# EAGLE design pcb-bldc-high-current (EAGLE 9.6.2)
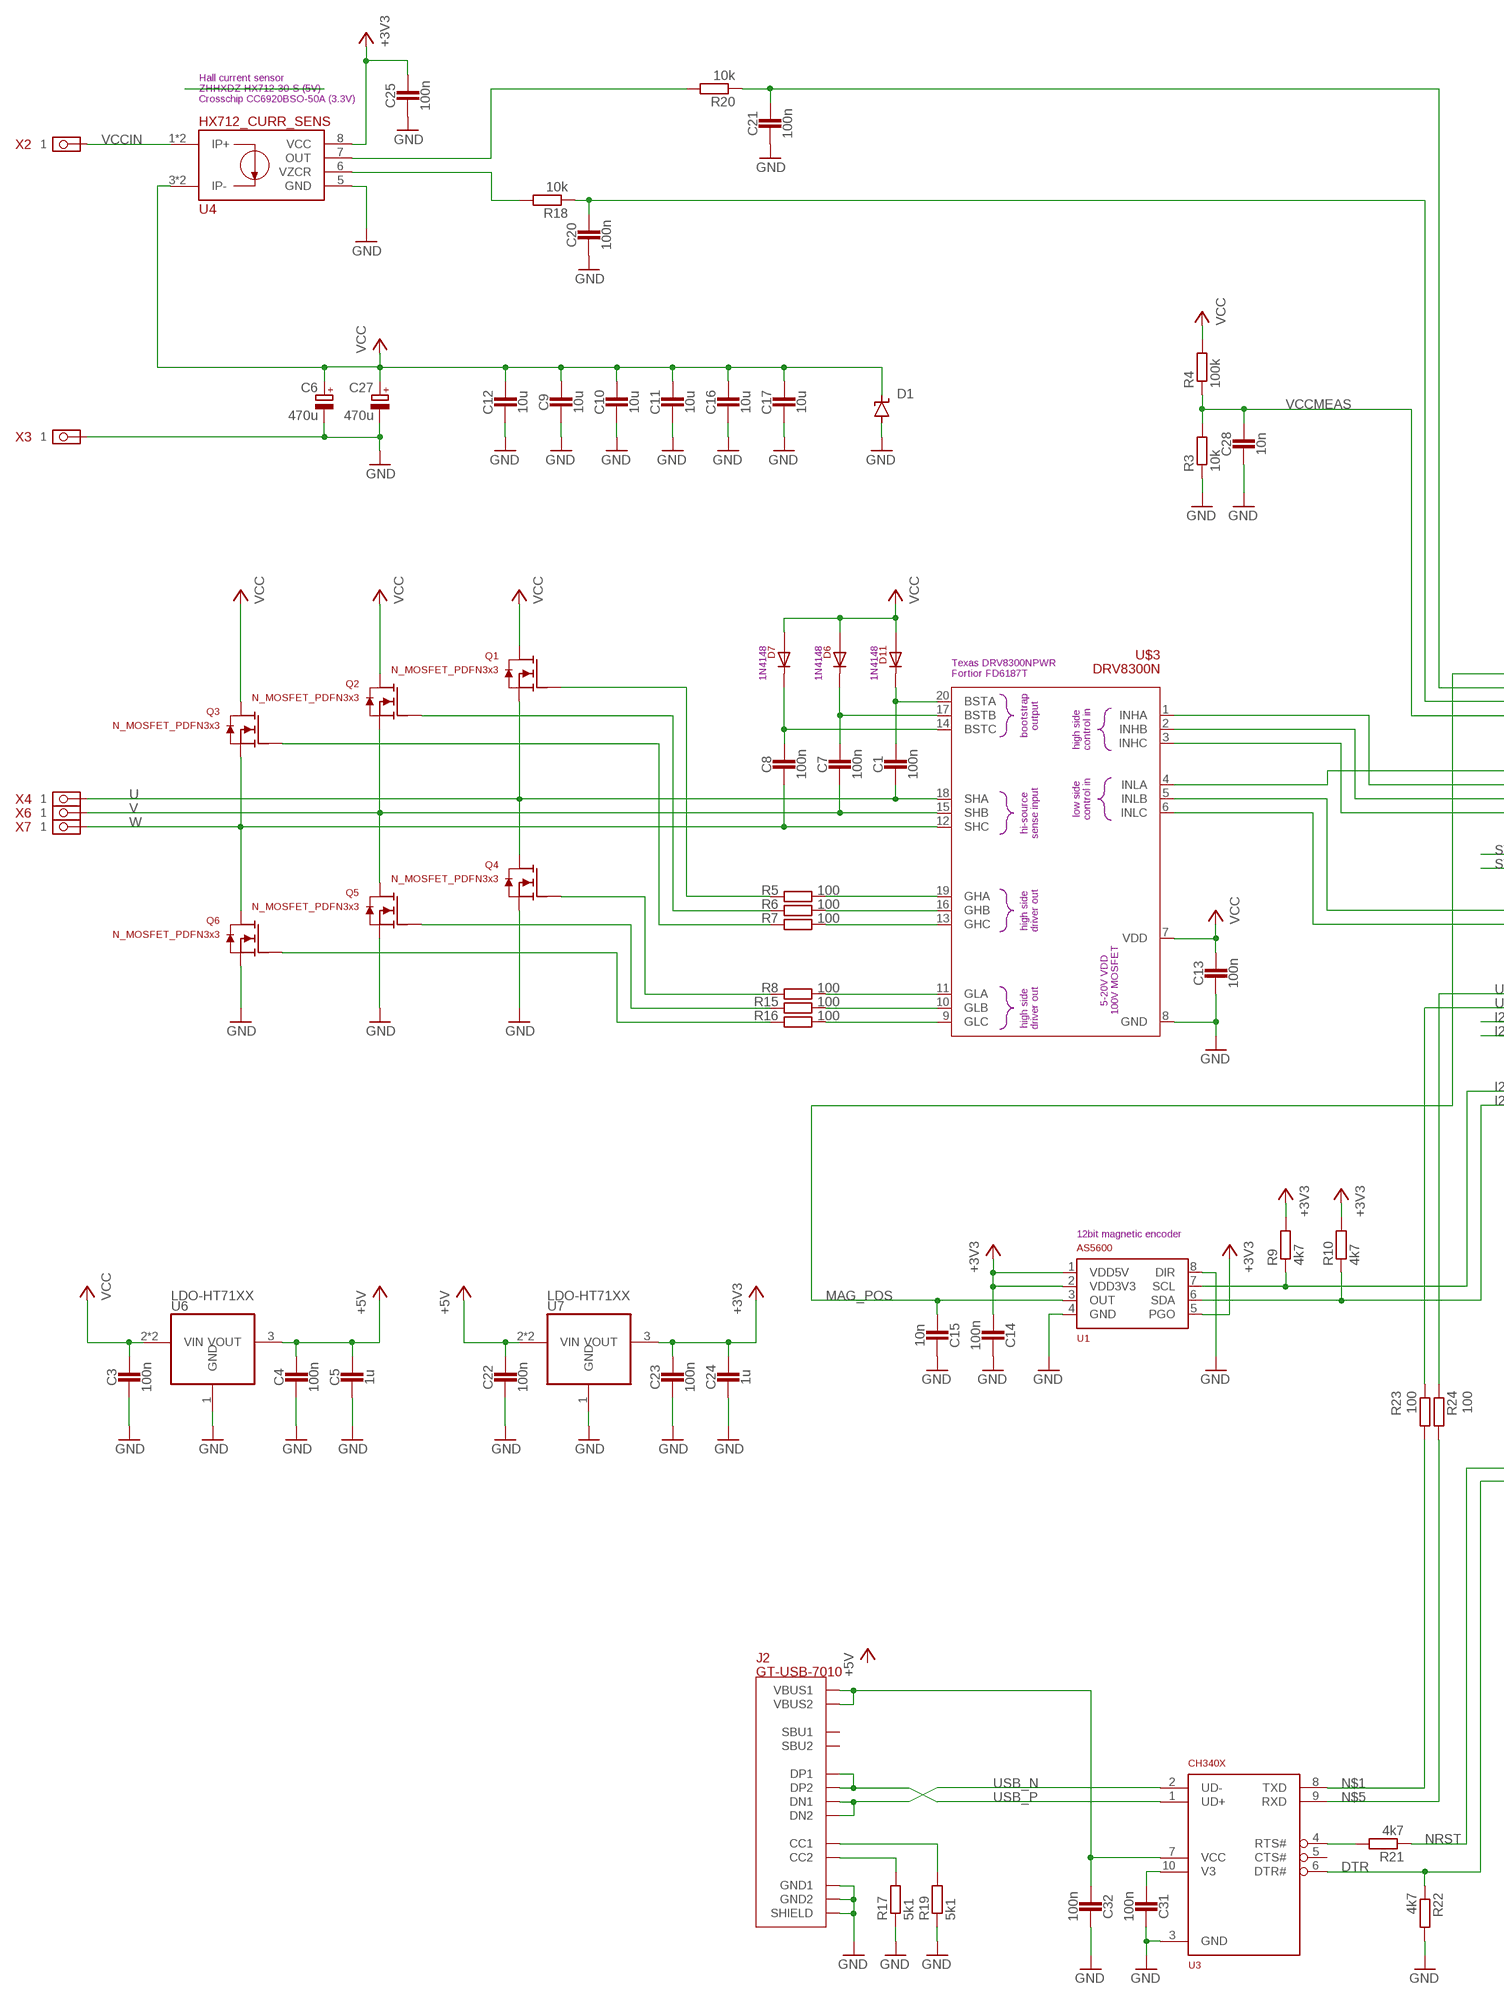
[diagram p0: schematic, sheet 1, part 1 of 2]
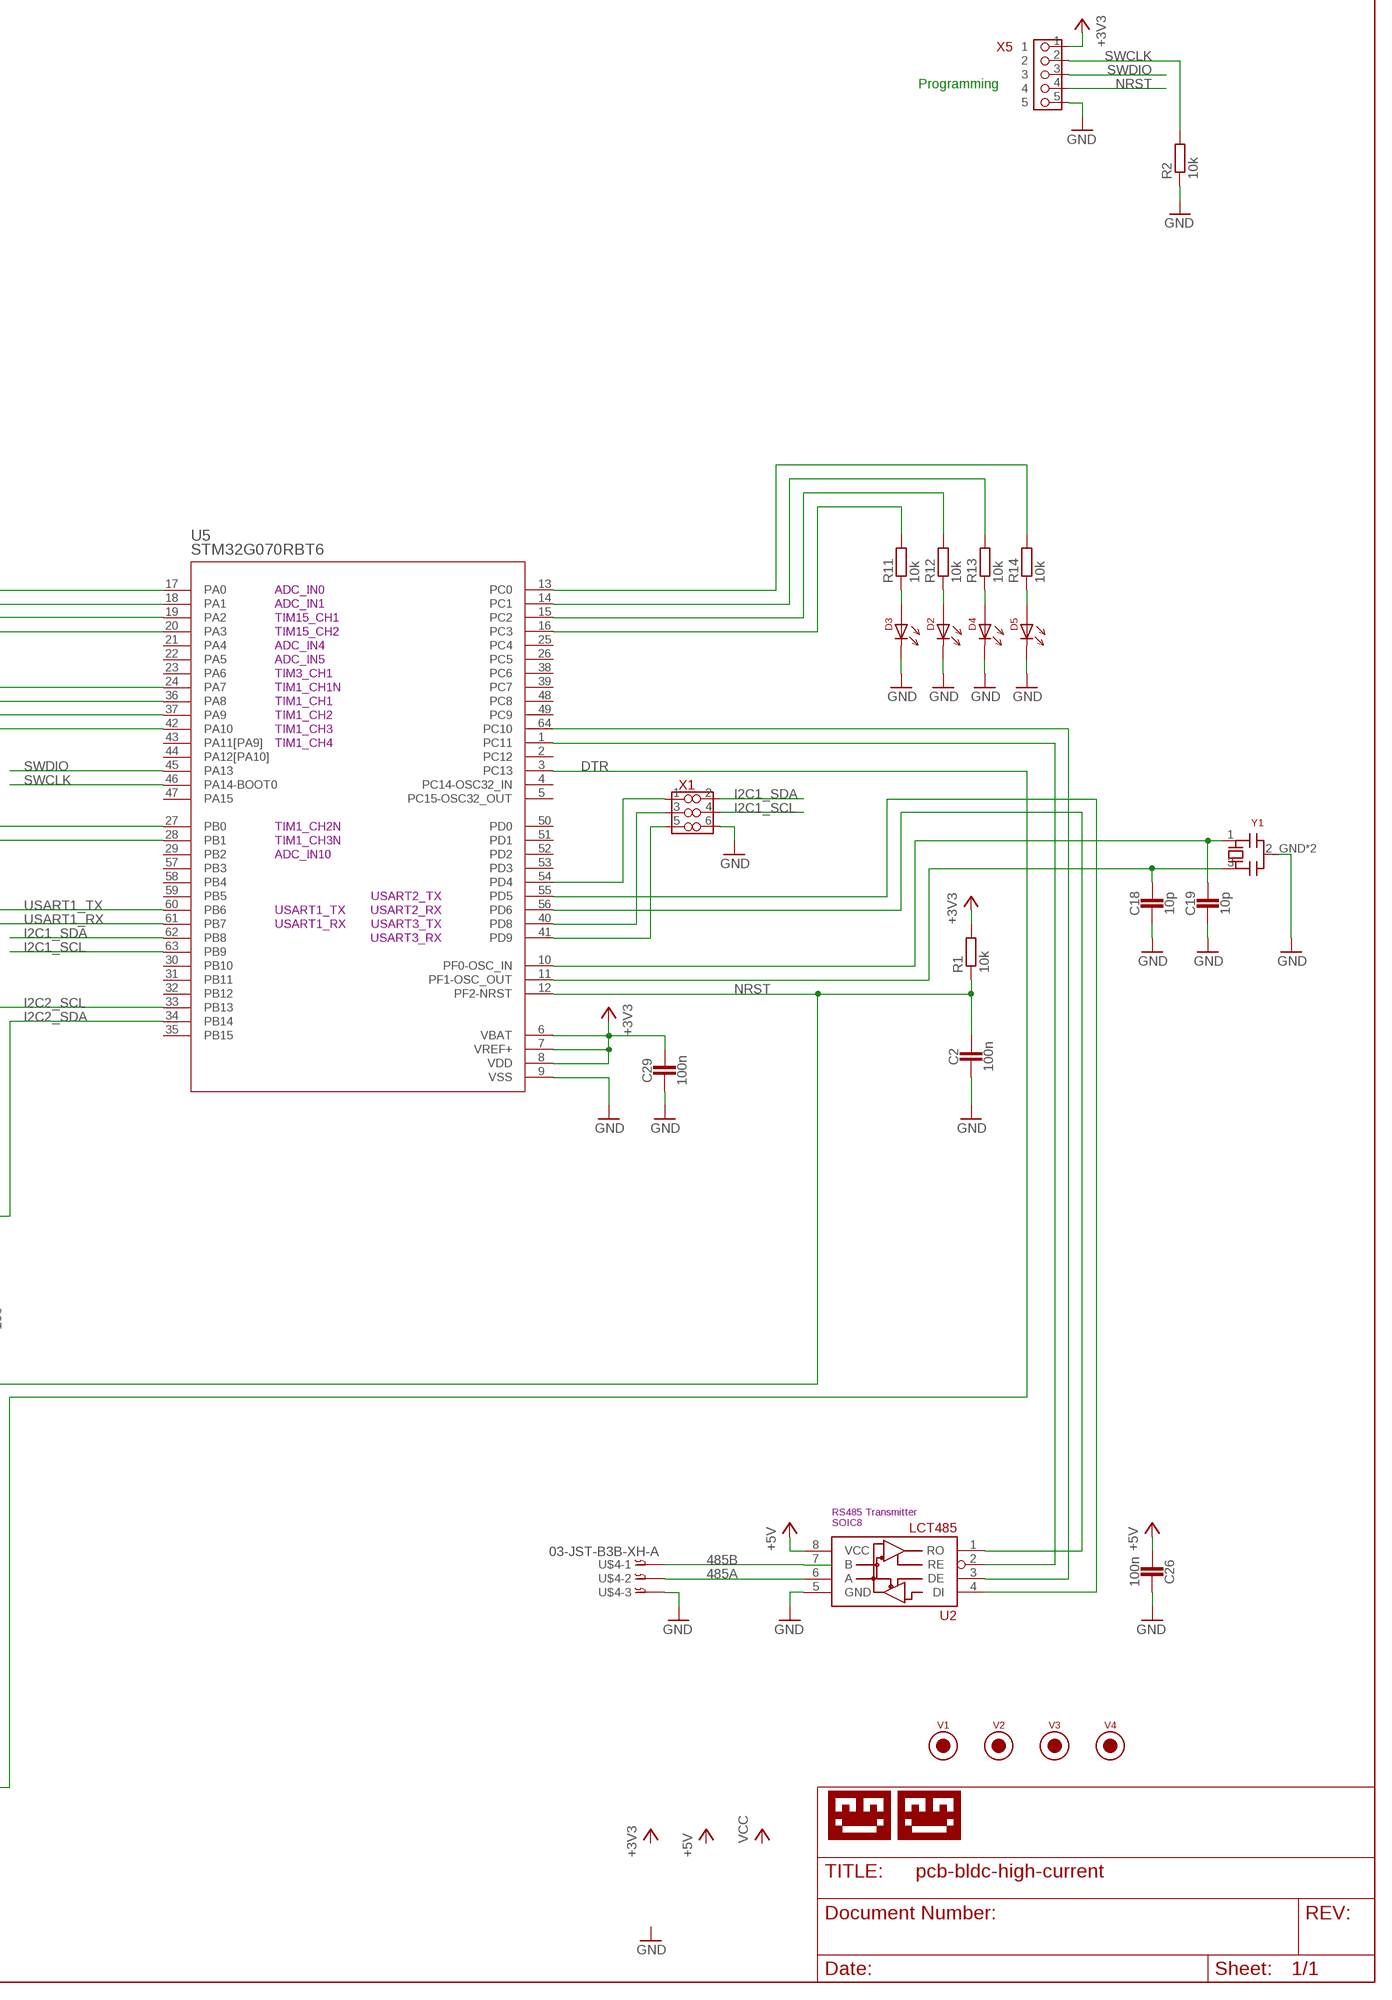
[diagram p1: schematic, sheet 1, part 2 of 2]

## Parts
C1  100n  CAPACITOR0603_CAP  [0603_CAP]
C2  100n  CAPACITOR0603_CAP  [0603_CAP]
C3  100n  CAPACITOR0603_CAP  [0603_CAP]
C4  100n  CAPACITOR0603_CAP  [0603_CAP]
C5  1u  CAPACITOR0603_CAP  [0603_CAP]
C6  470u  CPOL-EU153CLV-1010  [153CLV-1010]
C7  100n  CAPACITOR0603_CAP  [0603_CAP]
C8  100n  CAPACITOR0603_CAP  [0603_CAP]
C9  10u  CAPACITOR1206_CAP  [1206_CAP]
C10  10u  CAPACITOR1206_CAP  [1206_CAP]
C11  10u  CAPACITOR1206_CAP  [1206_CAP]
C12  10u  CAPACITOR1206_CAP  [1206_CAP]
C13  100n  CAPACITOR0603_CAP  [0603_CAP]
C14  100n  CAPACITOR0603_CAP  [0603_CAP]
C15  10n  CAPACITOR0603_CAP  [0603_CAP]
C16  10u  CAPACITOR1206_CAP  [1206_CAP]
C17  10u  CAPACITOR1206_CAP  [1206_CAP]
C18  10p  CAPACITOR0603_CAP  [0603_CAP]
C19  10p  CAPACITOR0603_CAP  [0603_CAP]
C20  100n  CAPACITOR0603_CAP  [0603_CAP]
C21  100n  CAPACITOR0603_CAP  [0603_CAP]
C22  100n  CAPACITOR0603_CAP  [0603_CAP]
C23  100n  CAPACITOR0603_CAP  [0603_CAP]
C24  1u  CAPACITOR0603_CAP  [0603_CAP]
C25  100n  CAPACITOR0603_CAP  [0603_CAP]
C26  100n  CAPACITOR0603_CAP  [0603_CAP]
C27  470u  CPOL-EU153CLV-1010  [153CLV-1010]
C28  10n  CAPACITOR0603_CAP  [0603_CAP]
C29  100n  CAPACITOR0603_CAP  [0603_CAP]
C31  100n  CAPACITOR0603_CAP  [0603_CAP]
C32  100n  CAPACITOR0603_CAP  [0603_CAP]
D1  SUPPRESSOR-SMBJ  [SMBJ]
D2  LED-0805  [0805-DOT]
D3  LED-0805  [0805-DOT]
D4  LED-0805  [0805-DOT]
D5  LED-0805  [0805-DOT]
D6  DIODESOD123  [SOD123]
D7  DIODESOD123  [SOD123]
D11  DIODESOD123  [SOD123]
J2  GT-USB-7010  [GT-USB-7010]
Q1  N_MOSFET_PDFN3x3  MOSFET_NHL60N04D  [DFN3X3-8L]
Q2  N_MOSFET_PDFN3x3  MOSFET_NHL60N04D  [DFN3X3-8L]
Q3  N_MOSFET_PDFN3x3  MOSFET_NHL60N04D  [DFN3X3-8L]
Q4  N_MOSFET_PDFN3x3  MOSFET_NHL60N04D  [DFN3X3-8L]
Q5  N_MOSFET_PDFN3x3  MOSFET_NHL60N04D  [DFN3X3-8L]
Q6  N_MOSFET_PDFN3x3  MOSFET_NHL60N04D  [DFN3X3-8L]
R1  10k  RESISTOR0603_RES  [0603-RES]
R2  10k  RESISTOR0603_RES  [0603-RES]
R3  10k  RESISTOR0603_RES  [0603-RES]
R4  100k  RESISTOR0603_RES  [0603-RES]
R5  100  RESISTOR0603_RES  [0603-RES]
R6  100  RESISTOR0603_RES  [0603-RES]
R7  100  RESISTOR0603_RES  [0603-RES]
R8  100  RESISTOR0603_RES  [0603-RES]
R9  4k7  RESISTOR0603_RES  [0603-RES]
R10  4k7  RESISTOR0603_RES  [0603-RES]
R11  10k  RESISTOR0603_RES  [0603-RES]
R12  10k  RESISTOR0603_RES  [0603-RES]
R13  10k  RESISTOR0603_RES  [0603-RES]
R14  10k  RESISTOR0603_RES  [0603-RES]
R15  100  RESISTOR0603_RES  [0603-RES]
R16  100  RESISTOR0603_RES  [0603-RES]
R17  5k1  RESISTOR0603_RES  [0603-RES]
R18  10k  RESISTOR0603_RES  [0603-RES]
R19  5k1  RESISTOR0603_RES  [0603-RES]
R20  10k  RESISTOR0603_RES  [0603-RES]
R21  4k7  RESISTOR0603_RES  [0603-RES]
R22  4k7  RESISTOR0603_RES  [0603-RES]
R23  100  RESISTOR0603_RES  [0603-RES]
R24  100  RESISTOR0603_RES  [0603-RES]
U1  AS5600  [SOIC-8]
U2  LCT485_BUS_TRANSCEIVER  [SOIC-8]
U3  CH340X  [MSOP-10]
U4  HX712_CURR_SENS  [SOIC-8]
U5  STM32G070RBT6  [LQFP-64]
U6  LDO-HT71XX  [SOT-89]
U7  LDO-HT71XX  [SOT-89]
U$1  LOGO-TOBENG-1MM-FINISH  [TOBENG-1MM-FINISH]
U$2  LOGO-0.25MM  [LOGO-0.25MM]
U$3  DRV8300N  DRV8300  [TSSOP20]
U$4  03-JST-B3B-XH-A  [B3B-XH]
V1  FIDUCIAL2MM  [FIDUCIAL_2MM]
V2  FIDUCIAL2MM  [FIDUCIAL_2MM]
V3  FIDUCIAL2MM  [FIDUCIAL_2MM]
V4  FIDUCIAL2MM  [FIDUCIAL_2MM]
X1  PIN_3X2HD  [PIN_3X2_HD]
X2  PIN_1X1WELDINGTERMINAL  [XFCNTS34031]
X3  PIN_1X1WELDINGTERMINAL  [XFCNTS34031]
X4  PIN_1X1WIRE1  [PIN_1X1_SOLDERWIRE_1]
X5  PIN_5X1HD  [PIN_5X1_HD]
X6  PIN_1X1WIRE1  [PIN_1X1_SOLDERWIRE_1]
X7  PIN_1X1WIRE1  [PIN_1X1_SOLDERWIRE_1]
Y1  3213-QUARZ3225  [3225-QUARZ]

## Nets
485A: U2.6(A) U$4.P$2
485B: U2.7(B) U$4.P$1
+3V3: C14.1 C23.1 C24.1 C25.1 C29.1 R1.2 R9.2 R10.2 U1.1(VDD5V) U1.2(VDD3V3) U1.5(PGO) U4.8(VCC) U5.6(VBAT) U5.7(VREF+) U5.8(VDD) U7.3(VOUT) X5.1
+5V: C4.1 C5.1 C22.1 C26.1 U2.8(VCC) U6.3(VOUT) U7.2(VIN) U7.2@1(VIN)
DTR: R22.1 U3.6(DTR#) U5.3(PC13)
GND: C2.2 C3.2 C4.2 C5.2 C6.- C9.2 C10.2 C11.2 C12.2 C13.2 C14.2 C15.2 C16.2 C17.2 C18.2 C19.2 C20.2 C21.2 C22.2 C23.2 C24.2 C25.2 C26.2 C27.- C28.2 C29.2 C31.2 C32.2 D1.A D2.2 D3.2 D4.2 D5.2 J2.13(SHIELD) J2.14(SHIELD) J2.15(SHIELD) J2.16(SHIELD) J2.A1B12(GND1) J2.B1A12(GND2) J2.PAD1(SHIELD) J2.PAD2(SHIELD) J2.PAD3(SHIELD) J2.PAD4(SHIELD) J2.PAD5(SHIELD) J2.PAD6(SHIELD) Q4.S1(S) Q4.S2(S) Q4.S3(S) Q5.S1(S) Q5.S2(S) Q5.S3(S) Q6.S1(S) Q6.S2(S) Q6.S3(S) R2.1 R3.1 R17.1 R19.1 R22.2 U1.4(GND) U1.8(DIR) U2.5(GND) U3.3(GND) U4.5(GND) U5.9(VSS) U6.1(GND) U7.1(GND) U$3.8(GND) U$4.P$3 X1.6 X3.1 X3.2 X3.3 X3.4 X5.5 Y1.2_GND Y1.4_GND
I2C1_SCL: U5.63(PB9) X1.4
I2C1_SDA: U5.62(PB8) X1.2
I2C2_SCL: R9.1 U1.7(SCL) U5.33(PB13)
I2C2_SDA: R10.1 U1.6(SDA) U5.34(PB14)
MAG_POS: C15.1 U1.3(OUT) U5.17(PA0)
N$1: R23.2 U3.8(TXD)
N$2: C18.1 U5.11(PF1-OSC_OUT) Y1.3
N$3: C19.1 U5.10(PF0-OSC_IN) Y1.1
N$4: C1.1 D11.C U$3.20(BSTA)
N$5: R24.2 U3.9(RXD)
N$6: C7.1 D6.C U$3.17(BSTB)
N$7: C8.1 D7.C U$3.14(BSTC)
N$8: D3.1 R11.1
N$10: U5.41(PD9) X1.5
N$11: Q4.G R8.2
N$12: Q5.G R15.2
N$13: Q6.G R16.2
N$14: Q1.G R5.2
N$15: Q2.G R6.2
N$16: Q3.G R7.2
N$17: D2.1 R12.1
N$18: D4.1 R13.1
N$19: D5.1 R14.1
N$20: R14.2 U5.13(PC0)
N$21: R13.2 U5.14(PC1)
N$22: R12.2 U5.15(PC2)
N$23: R11.2 U5.16(PC3)
N$24: U5.36(PA8) U$3.1(INHA)
N$25: U5.24(PA7) U$3.4(INLA)
N$26: U5.37(PA9) U$3.2(INHB)
N$27: U5.27(PB0) U$3.5(INLB)
N$28: U5.42(PA10) U$3.3(INHC)
N$29: U5.28(PB1) U$3.6(INLC)
N$30: R5.1 U$3.19(GHA)
N$31: R6.1 U$3.16(GHB)
N$32: R7.1 U$3.13(GHC)
N$33: R8.1 U$3.11(GLA)
N$34: R15.1 U$3.10(GLB)
N$35: R16.1 U$3.9(GLC)
N$36: C32.1 J2.A4B9(VBUS1) J2.B4A9(VBUS2) U3.7(VCC)
N$37: R21.2 U3.4(RTS#)
N$40: U5.40(PD8) X1.3
N$41: C20.1 R18.1 U5.19(PA2)
N$42: C21.1 R20.1 U5.18(PA1)
N$43: R18.2 U4.6(VZCR)
N$44: R20.2 U4.7(OUT)
N$45: U2.1(RO) U5.56(PD6)
N$46: U2.2(RE) U5.1(PC11)
N$47: U2.3(DE) U5.64(PC10)
N$48: U2.4(DI) U5.55(PD5)
N$49: U5.54(PD4) X1.1
N$51: J2.B5(CC2) R17.2
N$52: J2.A5(CC1) R19.2
N$53: C31.1 U3.10(V3)
NRST: C2.1 R1.1 R21.1 U5.12(PF2-NRST) X5.4
SWCLK: R2.2 U5.46(PA14-BOOT0) X5.2
SWDIO: U5.45(PA13) X5.3
U: C1.2 Q1.S1(S) Q1.S2(S) Q1.S3(S) Q4.D U$3.18(SHA) X4.P$1 X4.P$2 X4.P$3 X4.P$4 X4.P$5 X4.P$6 X4.P$7 X4.P$8 X4.P$9 X4.P$10 X4.P$11 X4.P$12 X4.P$13 X4.P$14 X4.P$15 X4.P$16 X4.P$17 X4.P$18 X4.P$19 X4.P$20
USART1_RX: R23.1 U5.61(PB7)
USART1_TX: R24.1 U5.60(PB6)
USB_N [usb]: J2.A7(DN1) J2.B7(DN2) U3.2(UD-)
USB_P [usb]: J2.A6(DP1) J2.B6(DP2) U3.1(UD+)
V: C7.2 Q2.S1(S) Q2.S2(S) Q2.S3(S) Q5.D U$3.15(SHB) X6.P$1 X6.P$2 X6.P$3 X6.P$4 X6.P$5 X6.P$6 X6.P$7 X6.P$8 X6.P$9 X6.P$10 X6.P$11 X6.P$12 X6.P$13 X6.P$14 X6.P$15 X6.P$16 X6.P$17 X6.P$18 X6.P$19 X6.P$20
VCC: C3.1 C6.+ C9.1 C10.1 C11.1 C12.1 C13.1 C16.1 C17.1 C27.+ D1.C D6.A D7.A D11.A Q1.D Q2.D Q3.D R4.2 U4.3(IP-) U4.4(IP-) U6.2(VIN) U6.2@1(VIN) U$3.7(VDD)
VCCIN: U4.1(IP+) U4.2(IP+) X2.1 X2.2 X2.3 X2.4
VCCMEAS: C28.1 R3.2 R4.1 U5.20(PA3)
W: C8.2 Q3.S1(S) Q3.S2(S) Q3.S3(S) Q6.D U$3.12(SHC) X7.P$1 X7.P$2 X7.P$3 X7.P$4 X7.P$5 X7.P$6 X7.P$7 X7.P$8 X7.P$9 X7.P$10 X7.P$11 X7.P$12 X7.P$13 X7.P$14 X7.P$15 X7.P$16 X7.P$17 X7.P$18 X7.P$19 X7.P$20
Unconnected: J2.A8(SBU1) J2.B8(SBU2) U3.5(CTS#) U5.2(PC12) U5.4(PC14-OSC32_IN) U5.5(PC15-OSC32_OUT) U5.21(PA4) U5.22(PA5) U5.23(PA6) U5.25(PC4) U5.26(PC5) U5.29(PB2) U5.30(PB10) U5.31(PB11) U5.32(PB12) U5.35(PB15) U5.38(PC6) U5.39(PC7) U5.43(PA11[PA9]) U5.44(PA12[PA10]) U5.47(PA15) U5.48(PC8) U5.49(PC9) U5.50(PD0) U5.51(PD1) U5.52(PD2) U5.53(PD3) U5.57(PB3) U5.58(PB4) U5.59(PB5)

## Notes on the sheet
- Hall current sensor
  ZHHXDZ HX712-30-S (5V)
  Crosschip CC6920BSO-50A (3.3V)
- Programming
- 1N4148 | 1N4148 | 1N4148
- Texas DRV8300NPWR
  Fortior FD6187T
- ADC_IN0
- ADC_IN1
- TIM15_CH1
- TIM15_CH2
- ADC_IN4
- ADC_IN5
- TIM3_CH1
- TIM1_CH1N
- TIM1_CH1
- TIM1_CH2
- TIM1_CH3
- TIM1_CH4
- TIM1_CH2N
- TIM1_CH3N
- ADC_IN10
- USART2_TX
- USART1_TX | USART2_RX
- USART1_RX | USART3_TX
- USART3_RX
- 12bit magnetic encoder
- RS485 Transmitter
  SOIC8

## Library data of the parts
C1-C5 C7-C26 C28 C29 C31 C32 = passives:CAPACITOR: SMD Capacitor
C6 C27 = resistor:CPOL-EU: POLARIZED CAPACITOR, European symbol
D1 = diode:SUPPRESSOR-: Suppressor diode
D2-D5 = ftobler:LED
D6 D7 D11 = ftobler:DIODE
J2 = ftobler:GT-USB-7010
Q1-Q6 = ftobler:MOSFET_N
R1-R24 = passives:RESISTOR: Resistor Basic schematic elements and footprints for 0201, 0402, 0603, 1206, and PTH resistors.
U1 = ftobler:AS5600
U2 = ftobler:LCT485_BUS_TRANSCEIVER
U3 = ftobler:CH340X
U4 = ftobler:HX712_CURR_SENS
U5 = stm32:STM32G070RBT6; COPYRIGHT: Copyright (C) 2024 Ultra Librarian. All rights reserved.; MANUFACTURER_PART_NUMBER: STM32G070RBT6; MFR_NAME: STMicroelectronics
U6 U7 = ftobler:LDO
U$1 U$2 = ftobler:LOGO
U$3 = ftobler:DRV8300
U$4 = bt_con-jst-xh:03-JST: JST CONNECTOR
V1-V4 = ftobler - Copy:FIDUCIAL
X1 = ftobler-conn:PIN_3X2
X2-X4 X6 X7 = ftobler-conn:PIN_1X1
X5 = ftobler-conn:PIN_5X1
Y1 = ftobler:3213-QUARZ

## Net classes
1 usb: width 0.18 mm, clearance 0.2 mm to class 0, clearance 0.15 mm
2 power: width 0.15 mm, clearance 0.2 mm to class 0, clearance 0.2 mm to class 1, clearance 0.2 mm

## Board
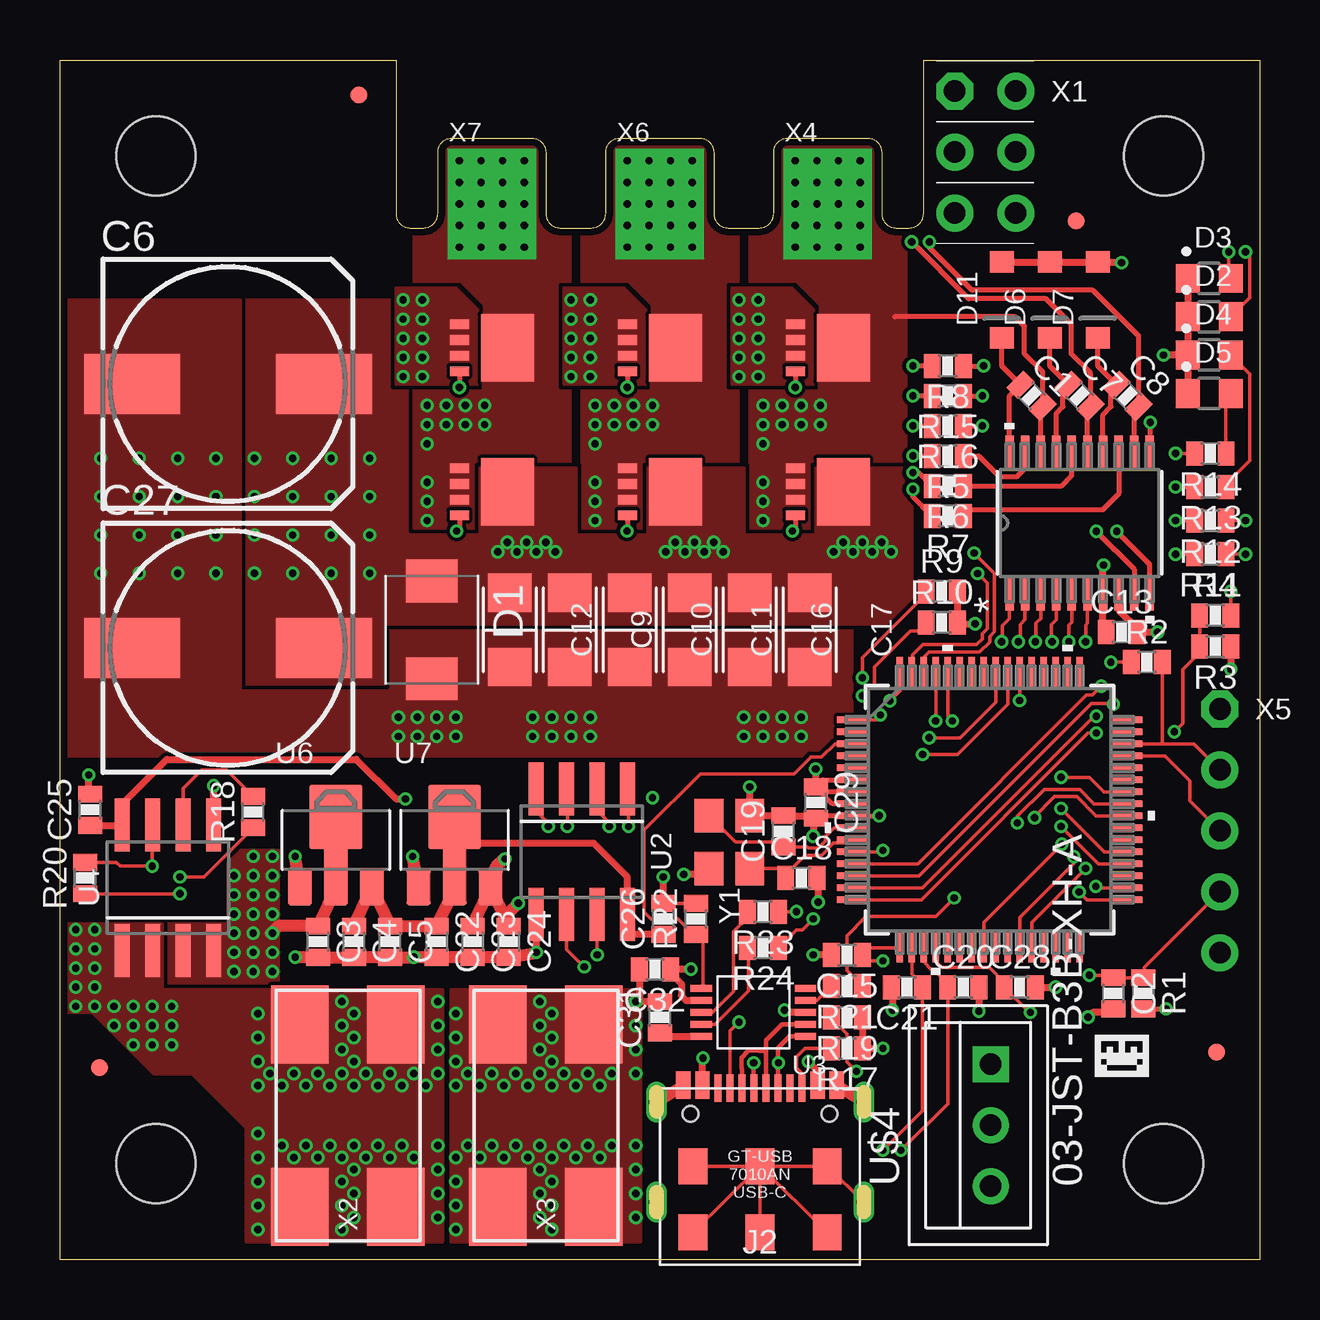
[diagram p2: board, top side]
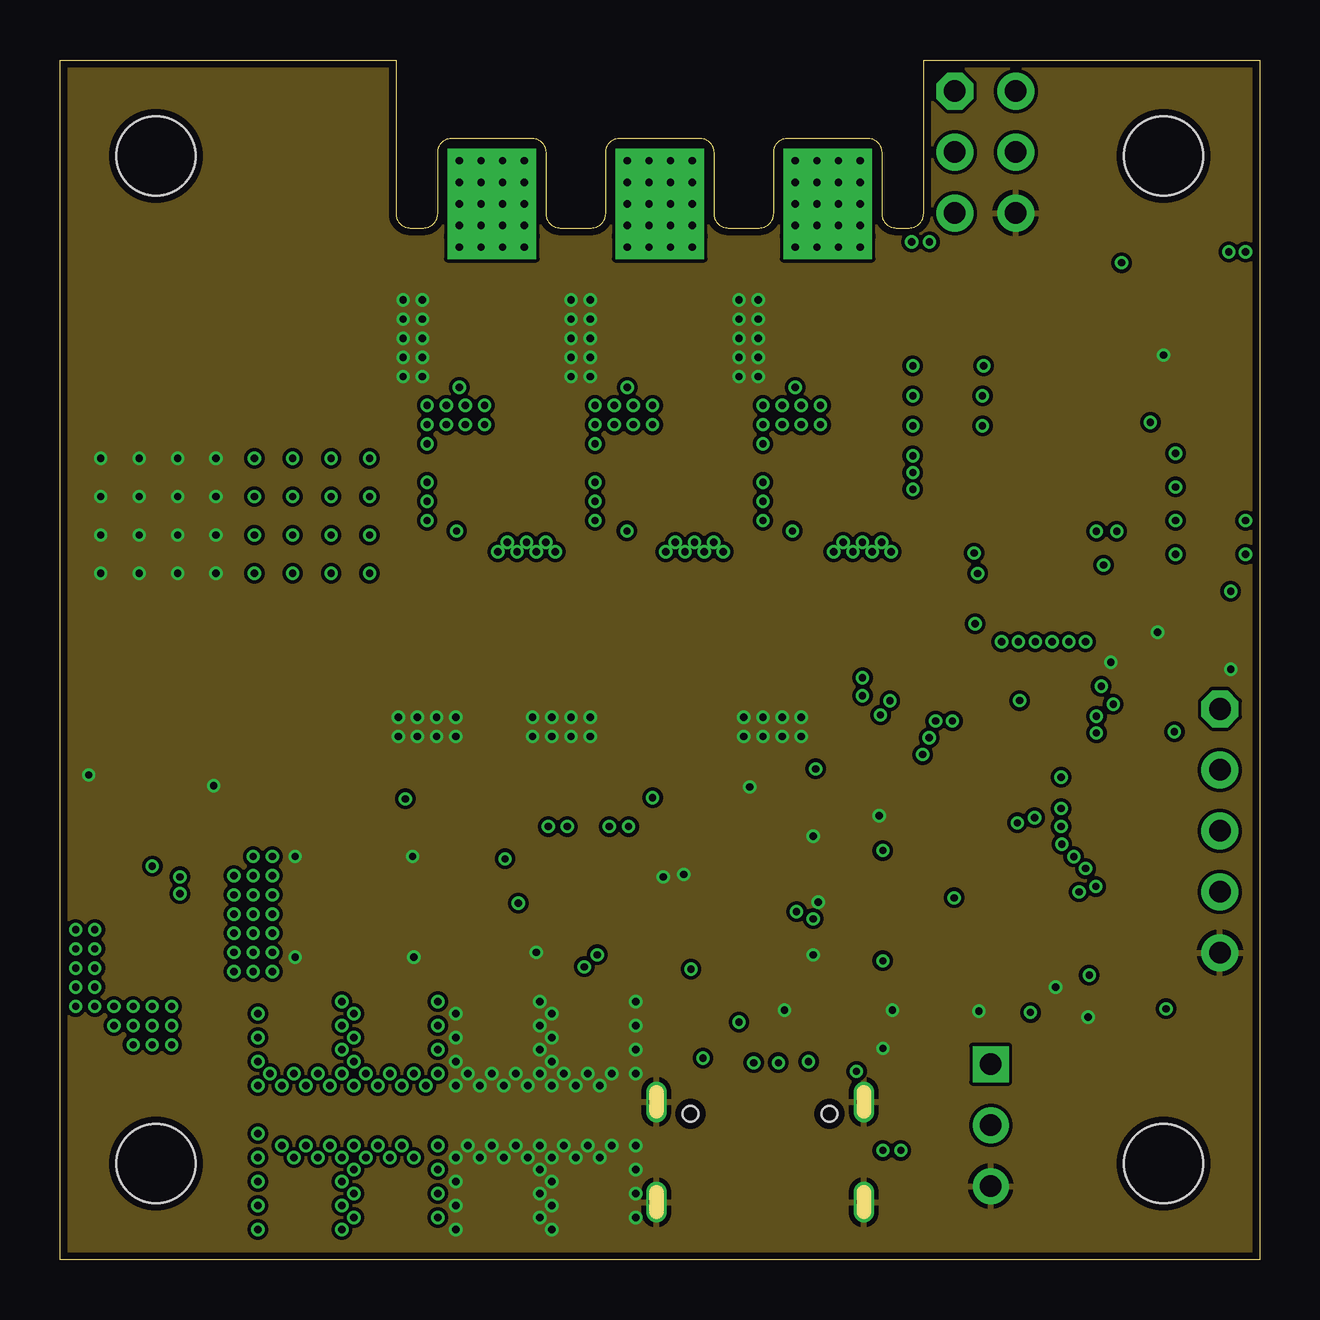
[diagram p3: board, inner layer Route2]
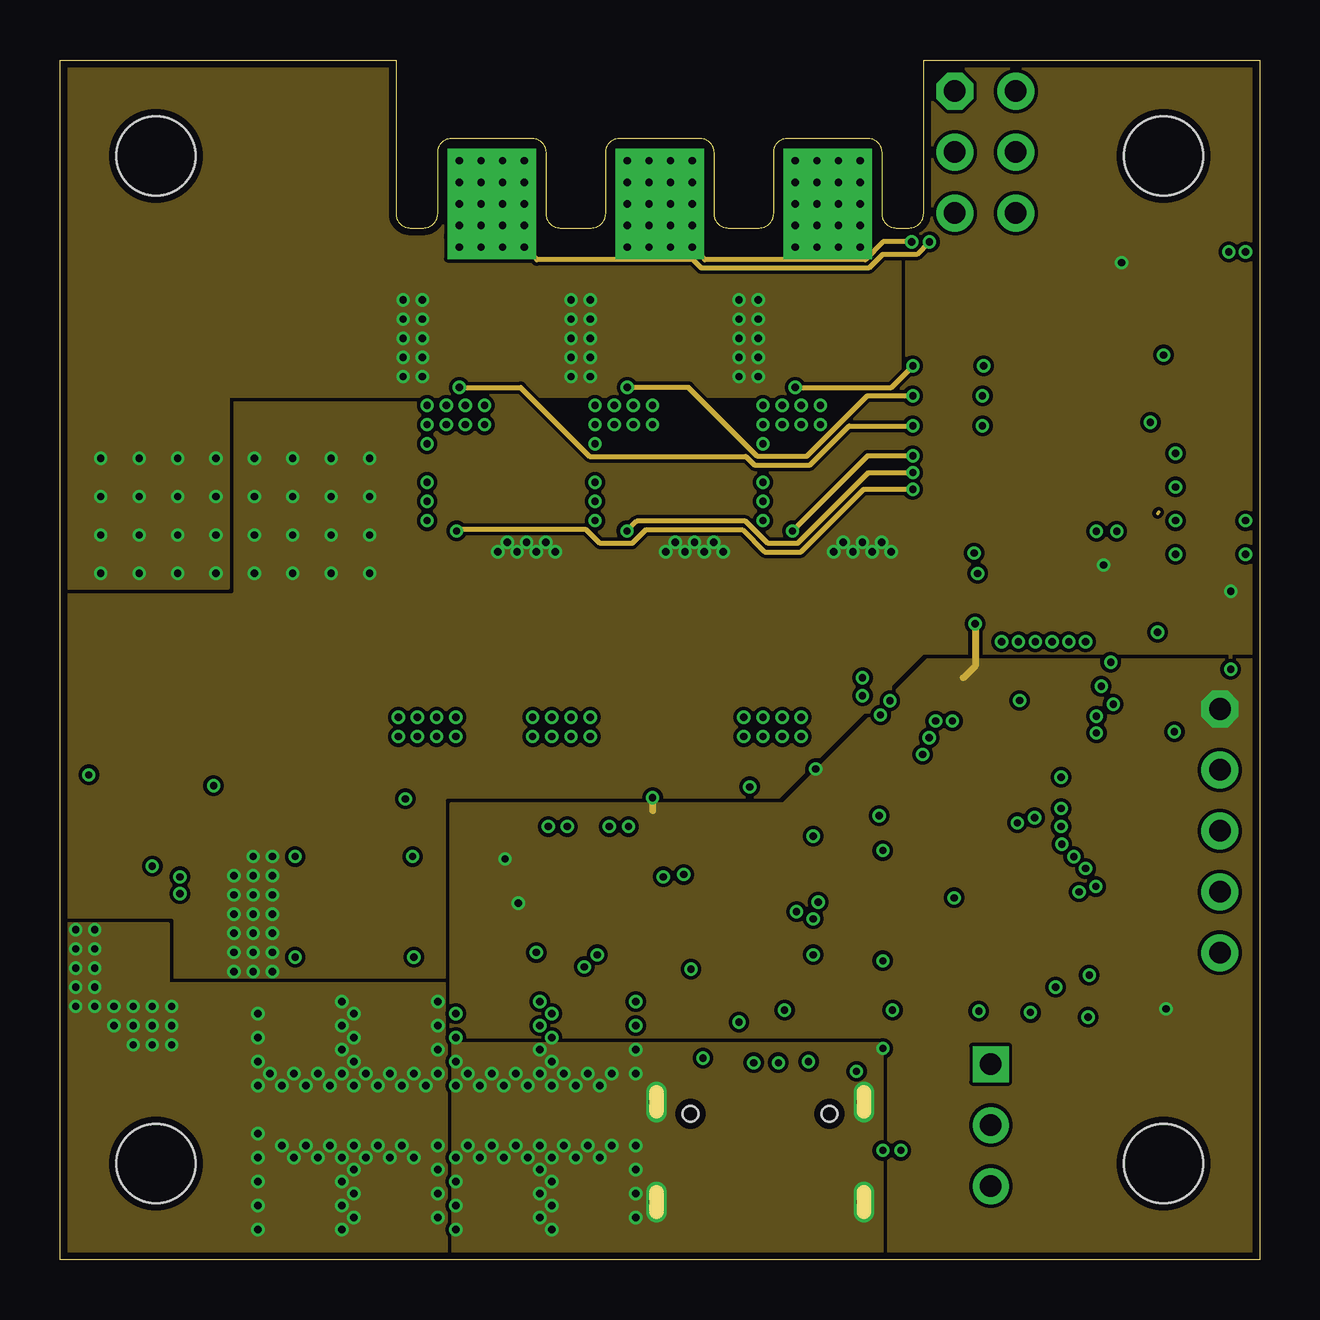
[diagram p4: board, inner layer Route15]
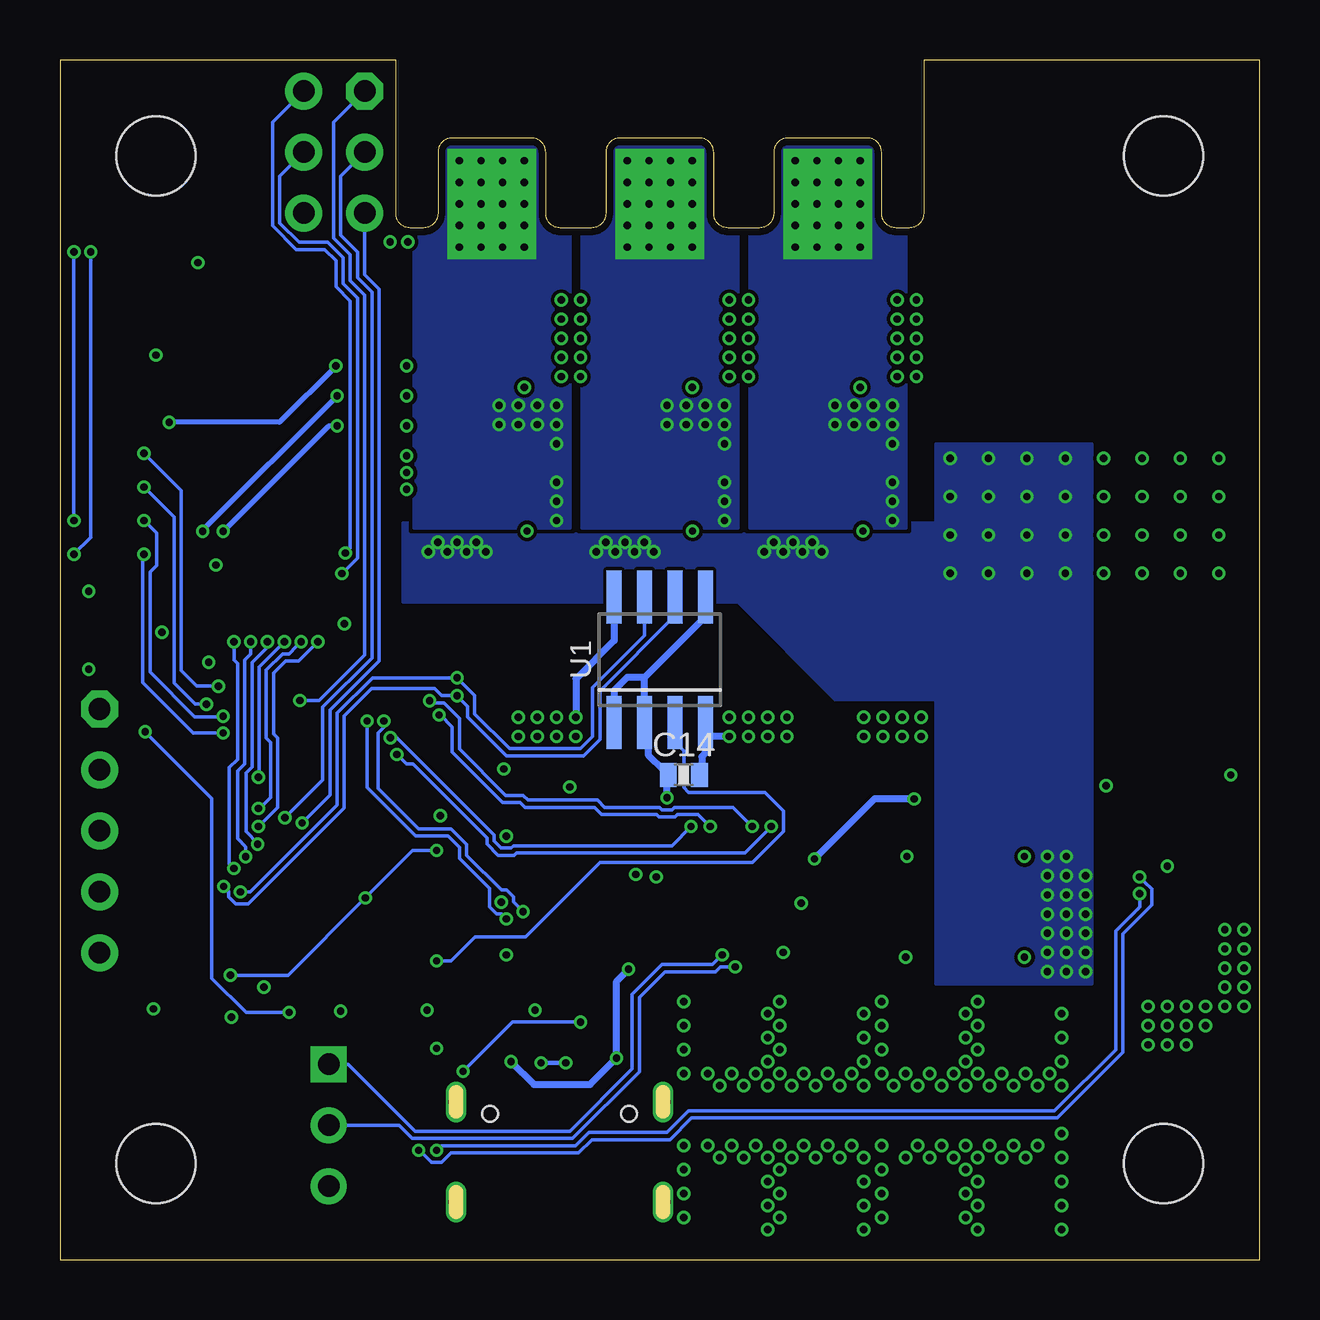
[diagram p5: board, bottom side, seen from below]

Size 50 x 50 mm. Coordinates in mm from the lower left corner, seen from the top.
Outline: 0,0 0,50 14,50 14,43.6 arc90 14.6,43 15.15,43 arc90 15.75,43.6 15.75,46.15 arc-90 16.35,46.75 19.65,46.75 arc-90 20.25,46.15 20.25,43.6 arc90 20.85,43 22.15,43 arc90 22.75,43.6 22.75,46.15 arc-90 23.35,46.75 26.65,46.75 arc-90 27.25,46.15 27.25,43.6 arc90 27.85,43 29.15,43 arc90 29.75,43.6 29.75,46.15 arc-90 30.35,46.75 33.65,46.75 arc-90 34.25,46.15 34.25,43.6 arc90 34.85,43 35.4,43 arc90 36,43.6 36,50 50,50 50,0 0,0
Copper layers (1+2*15+16): Top 0.035mm / dielectric 0.2mm / Route2 0.035mm / dielectric 0.4mm / Route15 0.035mm / dielectric 0.2mm / Bottom 0.035mm
Design rules "default *": minimum track width 0.15mm, minimum drill 0.2mm, track to track 0.15mm, track to pad 0.15mm, pad to pad 0.15mm, via to via 0.15mm, smd to smd 0.2mm, copper to edge 0.3mm, drill to drill 10mil, minimum pad ring 0.125mm, minimum via ring 0.125mm, stop-mask expansion 0.05mm, vias tented up to drill 0.35mm, thermal gap 0.2mm
Holes 3.3 mm at 4,46 46,46 46,4 4,4
tRestrict: area 0.7,42.7 to 7.3,49.3; area 42.7,42.7 to 49.3,49.3; area 42.7,0.7 to 49.3,7.3; area 0.7,0.7 to 7.3,7.3
bRestrict: area 0.7,42.7 to 7.3,49.3; area 42.7,42.7 to 49.3,49.3; area 0.7,0.7 to 7.3,7.3; area 42.7,0.7 to 49.3,7.3; 3 lines

### Footprints (pad centres in the part's own frame; a part is rotated, then mirrored left to right if it is on the bottom)
0603_CAP = smd 0.7 x 1: 1 -0.65,0; 2 0.65,0
153CLV-1010 = smd 4 x 2.5: + 4,0; - -4,0
1206_CAP = smd 1.6 x 1.8: 1 -1.55,0; 2 1.55,0
SMBJ = smd 1.78 x 2.16: A 2.04,0; C -2.03,0
0805-DOT = smd 1 x 1.2: 1 0.9,0; 2 -0.9,0
SOD123 = smd 0.9 x 1: A 1.58,0; C -1.58,0
GT-USB-7010 = drill 0.6 pad 0.8 long: 13 -4.32,0; 14 -4.32,-4.18; 15 4.32,0; 16 4.32,-4.18 | smd 0.6 x 1.14: A1B12 -3.2,0.7; A4B9 -2.4,0.7; B1A12 3.2,0.7; B4A9 2.4,0.7 | smd 0.3 x 1.14: A5 -1.25,0.575; A6 -0.25,0.575; A7 0.25,0.575; A8 1.25,0.575; B5 1.75,0.575; B6 0.75,0.575; B7 -0.75,0.575; B8 -1.75,0.575 | smd 1.2 x 1.5: PAD1 -2.8,-2.68; PAD2 -2.8,-5.43; PAD3 2.8,-2.68; PAD4 2.8,-5.43; PAD5 0,-5.43; PAD6 0,-2.68 | hole 0.65: -2.89,-0.5; 2.89,-0.5
DFN3X3-8L = smd 2.8 x 2.2: D 0,0.65 | smd 0.4 x 0.8: G 0.975,-1.35; S1 -0.975,-1.35; S2 -0.325,-1.35; S3 0.325,-1.35
0603-RES = smd 0.7 x 1: 1 -0.65,0; 2 0.65,0
SOIC-8 = smd 0.61 x 2.21: 1 -1.905,-2.616; 2 -0.635,-2.616; 3 0.635,-2.616; 4 1.905,-2.616; 5 1.905,2.616; 6 0.635,2.616; 7 -0.635,2.616; 8 -1.905,2.616
MSOP-10 = smd 0.889 x 0.305: 1 -2.171,1; 2 -2.171,0.5; 3 -2.171,0; 4 -2.171,-0.5; 5 -2.171,-1; 6 2.171,-1; 7 2.171,-0.5; 8 2.171,0; 9 2.171,0.5; 10 2.171,1
LQFP-64 = smd 1.302 x 0.279: 1 -5.706,3.75; 2 -5.706,3.25; 3 -5.706,2.75; 4 -5.706,2.25; 5 -5.706,1.75; 6 -5.706,1.25; 7 -5.706,0.75; 8 -5.706,0.25; 9 -5.706,-0.25; 10 -5.706,-0.75; 11 -5.706,-1.25; 12 -5.706,-1.75; 13 -5.706,-2.25; 14 -5.706,-2.75; 15 -5.706,-3.25; 16 -5.706,-3.75; 33 5.706,-3.75; 34 5.706,-3.25; 35 5.706,-2.75; 36 5.706,-2.25; 37 5.706,-1.75; 38 5.706,-1.25; 39 5.706,-0.75; 40 5.706,-0.25; 41 5.706,0.25; 42 5.706,0.75; 43 5.706,1.25; 44 5.706,1.75; 45 5.706,2.25; 46 5.706,2.75; 47 5.706,3.25; 48 5.706,3.75 | smd 0.279 x 1.302: 17 -3.75,-5.706; 18 -3.25,-5.706; 19 -2.75,-5.706; 20 -2.25,-5.706; 21 -1.75,-5.706; 22 -1.25,-5.706; 23 -0.75,-5.706; 24 -0.25,-5.706; 25 0.25,-5.706; 26 0.75,-5.706; 27 1.25,-5.706; 28 1.75,-5.706; 29 2.25,-5.706; 30 2.75,-5.706; 31 3.25,-5.706; 32 3.75,-5.706; 49 3.75,5.706; 50 3.25,5.706; 51 2.75,5.706; 52 2.25,5.706; 53 1.75,5.706; 54 1.25,5.706; 55 0.75,5.706; 56 0.25,5.706; 57 -0.25,5.706; 58 -0.75,5.706; 59 -1.25,5.706; 60 -1.75,5.706; 61 -2.25,5.706; 62 -2.75,5.706; 63 -3.25,5.706; 64 -3.75,5.706
SOT-89 = smd 1 x 1.5: 1 -1.499,-1.981; 3 1.499,-1.981 | smd 1 x 2.5: 2 0,-1.477 | smd 2.2 x 2.7: 2@1 0,0.94
TSSOP20 = smd 1.462 x 0.355: 1 -2.921,2.925; 2 -2.921,2.275; 3 -2.921,1.625; 4 -2.921,0.975; 5 -2.921,0.325; 6 -2.921,-0.325; 7 -2.921,-0.975; 8 -2.921,-1.625; 9 -2.921,-2.275; 10 -2.921,-2.925; 11 2.921,-2.925; 12 2.921,-2.275; 13 2.921,-1.625; 14 2.921,-0.975; 15 2.921,-0.325; 16 2.921,0.325; 17 2.921,0.975; 18 2.921,1.625; 19 2.921,2.275; 20 2.921,2.925
B3B-XH = drill 0.9 pad 1.5 square: P$1 2.54,0 | drill 0.9 pad 1.5: P$2 0,0; P$3 -2.54,0
FIDUCIAL_2MM = smd 0.7 x 0.7: V 0,0
PIN_3X2_HD = drill 0.9 pad 1.54 octagon: 1 0,0 | drill 0.9 pad 1.54: 2 2.54,0; 3 0,-2.54; 4 2.54,-2.54; 5 0,-5.08; 6 2.54,-5.08
XFCNTS34031 = smd 3.25 x 2.4: 1 -3.8,2; 2 3.8,2; 3 3.8,-2; 4 -3.8,-2
PIN_1X1_SOLDERWIRE_1 = drill 0.3 pad 1 square: P$1 -1.35,1.8; P$2 -0.45,1.8; P$3 0.45,1.8; P$4 1.35,1.8; P$5 1.35,-1.8; P$6 0.45,-1.8; P$7 1.35,0.9; P$8 0.45,0.9; P$9 -0.45,0.9; P$10 -1.35,0.9; P$11 -1.35,0; P$12 -0.45,0; P$13 0.45,0; P$14 1.35,0; P$15 -0.45,-1.8; P$16 -1.35,-1.8; P$17 1.35,-0.9; P$18 0.45,-0.9; P$19 -0.45,-0.9; P$20 -1.35,-0.9
PIN_5X1_HD = drill 0.9 pad 1.54 octagon: 1 0,0 | drill 0.9 pad 1.54: 2 0,-2.54; 3 0,-5.08; 4 0,-7.62; 5 0,-10.16
3225-QUARZ = smd 1.4 x 1.2: 1 -1.1,-0.85; 2_GND 1.1,-0.85; 3 1.1,0.85; 4_GND -1.1,0.85

### Placement (x,y rotation side)
C1  40.5,36 315 top
C2  43.9,11.1 270 top
C3  10.75,13.25 270 top
C4  12.25,13.25 270 top
C5  13.75,13.25 270 top
C6  7,36.5 0 top
C7  42.5,36 315 top
C8  44.5,36 315 top
C9  21.25,26.25 270 top
C10  23.75,26.25 270 top
C11  26.25,26.25 270 top
C12  18.75,26.25 270 top
C13  44.25,26.15 0 top
C14  24,20.2 0 bottom
C15  32.8,12.7 180 top
C16  28.75,26.25 270 top
C17  31.25,26.25 270 top
C18  30.9,15.9 0 top
C19  30.15,17.85 90 top
C20  37.65,11.35 0 top
C21  35.3,11.35 180 top
C22  15.7,13.25 270 top
C23  17.2,13.25 270 top
C24  18.7,13.25 270 top
C25  1.25,18.75 90 top
C26  25.15,14.2 90 top
C27  7,25.5 0 top
C28  40,11.35 0 top
C29  31.5,19.05 270 top
C31  25,10.1 90 top
C32  24.8,12.1 180 top
D1  15.5,26.25 270 top
D2  47.9,39.3 0 top
D3  47.9,40.9 0 top
D4  47.9,37.7 0 top
D5  47.9,36.1 0 top
D6  41.25,40 90 top
D7  43.25,40 90 top
D11  39.25,40 90 top
J2  29.18,6.57 0 top
Q1  32,32 270 top
Q2  25,32 270 top
Q3  18,32 270 top
Q4  32,38 270 top
Q5  25,38 270 top
Q6  18,38 270 top
R1  45.15,11.1 270 top
R2  45.3,24.9 0 top
R3  48.15,25.55 180 top
R4  48.15,26.85 0 top
R5  37,33.5 180 top
R6  37,32.25 180 top
R7  37,31 180 top
R8  37,37.25 180 top
R9  36.75,27.85 0 top
R10  36.75,26.55 0 top
R11  47.95,29.4 180 top
R12  47.95,30.8 180 top
R13  47.95,32.2 180 top
R14  47.95,33.6 180 top
R15  37,36 180 top
R16  37,34.75 180 top
R17  32.8,8.8 180 top
R18  8.05,18.65 90 top
R19  32.8,10.1 180 top
R20  1.05,15.9 90 top
R21  32.8,11.4 180 top
R22  26.5,14.2 90 top
R23  29.3,14.5 180 top
R24  29.3,13 180 top
U1  25,25 0 bottom
U2  21.75,17 180 top
U3  28.9,10.3 180 top
U4  4.5,15.5 0 top
U5  38.75,18.75 0 top
U6  11.5,17.5 0 top
U7  16.45,17.5 0 top
U$1  7.55,38.9 0 bottom
U$2  44.25,8.5 0 top
U$3  42.5,30.7 90 top
U$4  38.8,5.6 90 top
V1  12.45,48.55 90 top
V2  42.35,43.3 0 top
V3  48.2,8.65 0 top
V4  1.65,8 0 top
X1  37.3,48.7 0 top
X2  12,6 90 top
X3  20.25,6 90 top
X4  32,44 0 top
X5  48.35,22.95 0 top
X6  25,44 0 top
X7  18,44 0 top
Y1  27.9,17.4 270 top

### Tracks (layer width: path | path; a pad name or v marks a point on that pad's centre or on a via)
485A  (via drill 0.3)
  Top 0.15: U2.6 21.11,12.94 v21.85,12.2
  Top 0.2: U2.6
  Bottom 0.15: v21.85,12.2 22.48,12.2 22.68,12 24.78,12 25.85,10.93 25.85,7.83 28.63,5.05 35.32,5.05 35.87,5.6 U$4.P$2
485B  (via drill 0.3)
  Top 0.15: U2.7 22.39,12.71 v22.4,12.7
  Bottom 0.15: v22.4,12.7 22.8,12.3 24.9,12.3 26.15,11.05 26.15,7.95 28.75,5.35 35.2,5.35 37.99,8.14 U$4.P$1
+3V3  (via drill 0.3)
  Top 0.15: 31.65,19.55 C29.1
  Top 0.2: R1.2 v46.1,10.45 | U5.6 31.8,20 C29.1 31.7,19.5 U5.7 | U5.8 32.2,19 31.65,19.55
  Top 0.3: C29.1 v31.5,20.45 | R9.2 R10.2 37.45,26.5 v38.15,26.5 | C25.1 2.58,18.1 U4.8 2.6,19 4.45,20.85 12.35,20.85 14,19.2 v14.4,19.2
  Top 0.5: C23.1 U7.3 | U7.3 C24.1 18.7,14.45 v19.1,14.85 | v18.55,16.7 18.5,16.7 18.16,16.36 U7.3
  Route15 0.3: v24.7,19.25 24.7,18.7 | v38.15,26.5 38.15,24.75 37.65,24.25
  Bottom 0.3: U1.5 23.09,26.8 25.64,24.27 | 25.64,24.27 U1.2 25.48,22.23 25.48,21.04 24.85,20.4 24.75,20.4 24.65,20.3 C14.1 24.7,20.15 v24.7,19.25 | 25.64,24.27 26.36,24.27 26.91,23.71 U1.1 | v14.4,19.2 16.05,19.2 v18.55,16.7
  pour Route15 (rank 2, no thermals): 51,25 36.15,25 30.15,19 16.3,19 16.3,-1.75 51,-1.75
+5V
  Top 0.3: 23.66,13.45 23.66,13.55 | 23.66,13.55 U2.8 23.66,15.95 22.25,17.35 17.4,17.35 16.45,18.3 U7.2@1 | C26.1 23.66,13.55
  Top 0.5: U7.2@1 U7.2 16.3,15.1 C22.1 C5.1 U6.3 C4.1
DTR
  Top 0.15: U5.3 32.29,21.5 31.74,20.95 31.29,20.95 30.59,20.25 26.7,20.25 24.35,17.9 24.35,14.48 24.63,14.2 25.75,14.2 26.4,13.55 R22.1 26.8,13.25 26.8,11.37 U3.6
GND  (via drill 0.3)
  Top 0.15: R2.1 v43.8,24.9 | J2.PAD6 J2.PAD1 | J2.PAD6 J2.PAD2 | J2.PAD6 J2.PAD5 | J2.PAD6 J2.PAD4 | J2.PAD6 J2.PAD3 J2.16 | R22.2 C26.2
  Top 0.2: v34.15,18.5 U5.9 31.4,18.5
  Top 0.3: D3.2 D2.2 D4.2 | D4.2 D5.2 | D4.2 v46,37.7 | U2.5 v19.84,12.79 v19.85,12.8 | C2.2 43.75,10.3 43.05,10.3 v42.85,10.1 | U$3.8 44.12,27.07 44.9,26.3 C13.2 v45.75,26.15 | C25.2 1.2,19.45 v1.2,20.2 | U4.5 v6.41,19.75 v6.4,19.75 | v31.4,17.65 31.4,18.3 C29.2 31.4,18.5 C19.2 Y1.4_GND v28.75,19.7 | U3.3 30.3,10.3 v30.2,10.4 | C15.2 v31.4,12.7 | C21.2 34.7,11.3 v34.7,10.4 | v34.3,8.8 R17.1 R19.1 | C28.2 v41.5,11.35 | C20.2 v38.3,10.35 | C26.2 v25.15,15.95 | Y1.2_GND 26.8,16.05 v26,16.05 | C18.2 31.6,15.85 v31.6,14.9 | C31.2 v24,10.75 24.15,10.9 C32.2 | R3.1 v48.8,24.6
  Top 0.5: U6.1 v9.8,16.8 | v9.8,12.6 C3.2 C4.2 C5.2 v14.75,12.6 C22.2 C23.2 C24.2 19.84,12.78 | U7.1 v14.7,16.8 | J2.13 J2.A1B12 | J2.B1A12 J2.15
  Bottom 0.3: U1.8 26.91,25.8 28.5,24.2 v28.5,22.6 | U1.4 23.09,21.8 | 23.09,21.8 23.09,21.11 23.25,20.95 23.25,20.3 C14.2 | v22.1,21.8 23.09,21.8
  other vias: 14.3,36.8 28.3,36.8 21.3,36.8 14.3,37.6 14.3,38.4 14.3,39.2 14.3,40 21.3,37.6 21.3,38.4 21.3,39.2 21.3,40 28.3,37.6 28.3,38.4 28.3,39.2 28.3,40 15.1,40 15.1,39.2 15.1,37.6 15.1,36.8 22.1,40 22.1,39.2 22.1,38.4 22.1,37.6 22.1,36.8 29.1,40 29.1,39.2 29.1,38.4 29.1,37.6 29.1,36.8 15.1,38.4 14.9,22.6 14.9,21.8 15.7,22.6 15.7,21.8 16.5,21.8 16.5,22.6 19.7,21.8 19.7,22.6 20.5,22.6 20.5,21.8 21.3,21.8 21.3,22.6 22.1,22.6 28.5,21.8 29.3,22.6 29.3,21.8 30.1,21.8 30.1,22.6 30.9,22.6 30.9,21.8 14.1,22.6 14.1,21.8 6.5,33.4 4.9,33.4 3.3,33.4 1.7,33.4 1.7,31.8 3.3,31.8 4.9,31.8 6.5,31.8 6.5,30.2 4.9,30.2 3.3,30.2 1.7,30.2 1.7,28.6 3.3,28.6 4.9,28.6 6.5,28.6 20,10.75 20.5,10.25 20,9.75 20.5,9.25 20,8.75 20.5,8.25 20,3.75 20.5,3.25 20,2.75 20.5,2.25 20,1.75 20.5,1.25 20,7.75 20.5,7.25 19.5,7.25 19,7.75 18.5,7.25 18,7.75 17.5,7.25 21,7.75 21.5,7.25 22,7.75 22.5,7.25 23,7.75 20.5,4.25 20,4.75 19.5,4.25 19,4.75 18.5,4.25 18,4.75 17.5,4.25 21,4.75 21.5,4.25 22,4.75 22.5,4.25 23,4.75 17,7.75 16.5,7.25 16.5,8.25 16.5,9.25 16.5,10.25 17,4.75 16.5,4.25 16.5,3.25 16.5,2.25 16.5,1.25 24,7.75 24,8.75 24,9.75 24,4.75 24,3.75 24,2.75 24,1.75
  pour Route2 (rank 2): -1,51 51,51 51,-1 -1,-1
  pour Top (no thermals): 18,36.5 18,39 16.5,40.5 14,40.5 14,36.5
  pour Top (no thermals): 25,36.5 25,39 23.5,40.5 21,40.5 21,36.5
  pour Top (no thermals): 32,36.5 32,39 30.5,40.5 28,40.5 28,36.5
  pour Top (rank 4, no thermals): -1,26.5 33,26.5 33,21 -1,21
  pour Top (no thermals): 7.5,40 -0.5,40 -0.5,22 7.5,22
  pour Route15 (no thermals): -1,51 -1,28 7,28 7,36 35,36 35,43.5 15,43.5 15,51
  pour Top (no thermals): 16.3,11.25 24.2,11.25 24.2,0.75 16.3,0.75
  pour Route15 (no thermals): 16.38,9 34.25,9 34.25,-2.25 16.38,-2.25
I2C1_SCL  (via drill 0.3)
  Top 0.15: U5.63 35.53,24.49 35.53,25.2 35.97,25.63 38.21,25.63 38.45,25.87 38.45,26.09 38.65,26.29 38.65,28.19 v38.25,28.6
  Bottom 0.15: X1.4 40.84,45.16 40.84,43.21 40.03,42.4 38.85,42.4 38.2,41.75 38.2,40.68 37.6,40.08 37.6,29.24 v38.25,28.6
I2C1_SDA  (via drill 0.3)
  Top 0.15: U5.62 36,25.11 36.22,25.33 38.33,25.33 38.75,25.75 38.75,25.97 38.95,26.17 38.95,28.6 v38.1,29.45
  Bottom 0.15: X1.2 41.13,47.41 41.13,43.08 40.15,42.1 38.97,42.1 38.5,41.63 38.5,40.55 37.9,39.95 37.9,29.65 v38.1,29.45
I2C2_SCL  (via drill 0.3)
  Top 0.15: R9.1 36.1,27.75 33.45,25.1 v33.45,24.25 | v42.48,15.32 42.8,15 U5.33
  Bottom 0.15: U1.7 25.64,26.02 27.8,23.85 27.8,21.79 28.29,21.3 31.27,21.3 32.71,22.74 32.71,23.51 v33.45,24.25 36.97,24.25 38.45,22.77 38.45,18.95 42.08,15.32 v42.48,15.32
I2C2_SDA  (via drill 0.3)
  Top 0.15: R10.1 36.1,26.45 35.85,26.2 35.45,26.2 33.95,24.7 33.95,24 v33.45,23.5 | v43.18,15.55 43.23,15.5 U5.34
  Bottom 0.15: U1.6 24.36,26.84 27.5,23.7 27.5,21.67 28.17,21 31.39,21 33.01,22.62 33.01,23.06 v33.45,23.5 v33.46,23.51 34.1,23.51 34.39,23.8 37.01,23.8 38.15,22.65 38.15,18.83 42.15,14.82 42.69,14.82 42.98,15.11 42.98,15.35 v43.18,15.55
MAG_POS  (via drill 0.3)
  Top 0.15: U5.17 34.96,13 33.6,13 33.45,12.85 C15.1 33.45,12.5 33.5,12.45 v34.3,12.45
  Bottom 0.15: U1.3 24.36,21.57 24,21.2 24,19.68 23.79,19.48 20.62,19.48 19.85,18.7 19.85,17.84 21.14,16.55 27.5,16.55 30.6,13.45 32.7,13.45 33.7,12.45 v34.3,12.45
N$1
  Top 0.15: U3.8 27.2,10.3 28.07,11.18 28.07,13.68 28.65,14.25 R23.2
N$2
  Top 0.15: U5.11 32.91,17.36 32.25,17.36 31.73,16.85 31.05,16.85 30.25,16.05 | 30.25,16.05 C18.1 | Y1.3 30,16.3 30.25,16.05
N$3
  Top 0.15: Y1.1 28.15,17.4 29.95,17.4 C19.1 31.14,17.2 31.19,17.15 31.61,17.15 31.9,17.44 31.9,17.63 32.27,18 U5.10
N$4
  Top 0.2: D11.C 39.25,37.25 C1.1 39.58,35.99 U$3.20
N$5
  Top 0.15: U3.9 27.3,9.8 28.7,11.2 28.7,13.2 28.65,13.15 R24.2
N$6
  Top 0.2: D6.C 41.25,37.25 C7.1 41.81,36.23 41.81,35.54 41.52,35.26 U$3.17
N$7
  Top 0.2: D7.C 43.25,37.25 C8.1 43.81,36.23 43.81,35.54 43.48,35.21 U$3.14
N$8  (via drill 0.3)
  Top 0.15: D3.1 48.72,40.98 v48.72,42 | v49.42,29.4 R11.1
  Bottom 0.15: v48.72,42 48.72,30.1 v49.42,29.4
N$9
  Route15 0.15: 45.75,31.1 45.8,31.15
N$10  (via drill 0.3)
  Top 0.15: U5.41 43.1,19 42.5,19.6 41.02,19.6 39.91,18.48 v39.91,18.2
  Bottom 0.15: X1.5 37.3,41.05 36.7,40.45 36.7,24.95 38.75,22.9 38.75,19.36 v39.91,18.2
N$11  (via drill 0.3)
  Top 0.2: Q4.G v30.65,36.35 | R8.2 v35.55,37.25
  Route15 0.2: v30.65,36.35 34.65,36.35 v35.55,37.25
N$12  (via drill 0.3)
  Top 0.2: Q5.G v23.65,36.35 | R15.2 v35.55,36
  Route15 0.2: v35.55,36 33.64,36 31.12,33.48 29.08,33.48 26.21,36.35 v23.65,36.35
N$13  (via drill 0.3)
  Top 0.2: Q6.G v16.65,36.35 | R16.2 v35.55,34.75
  Route15 0.2: v16.65,36.35 19.21,36.35 22.08,33.48 28.59,33.48 28.94,33.12 31.26,33.12 32.89,34.75 v35.55,34.75
N$14  (via drill 0.3)
  Top 0.2: Q1.G 30.65,30.49 v30.53,30.37 | R5.2 v35.55,33.5
  Route15 0.2: v35.55,33.5 33.66,33.5 v30.53,30.37
N$15  (via drill 0.3)
  Top 0.2: Q2.G 23.65,30.39 v23.63,30.37 | R6.2 35.8,32.8 v35.55,32.8
  Route15 0.2: v35.55,32.8 33.7,32.8 30.75,29.84 29.51,29.84 28.58,30.77 24.04,30.77 v23.63,30.37
N$16  (via drill 0.3)
  Top 0.2: Q3.G 16.65,30.49 v16.53,30.37 | v35.55,32.1 35.55,31.8 R7.2
  Route15 0.2: v35.55,32.1 33.5,32.1 30.89,29.5 29.37,29.5 28.44,30.43 24.43,30.43 23.85,29.84 22.51,29.84 21.93,30.43 16.59,30.43 v16.53,30.37
N$17  (via drill 0.3)
  Top 0.15: D2.1 49.59,40.09 49.59,41.83 v49.42,42 | R12.1 v49.42,30.8
  Bottom 0.15: v49.42,30.8 v49.42,42
N$18
  Top 0.15: D4.1 49.59,36.91 49.59,33.3 48.6,32.3 R13.1
N$19
  Top 0.15: R14.1 48.6,35.9 D5.1
N$20  (via drill 0.3)
  Top 0.15: U5.13 35.75,16.5 42.77,23.52 43.02,23.52 v43.4,23.9 | R14.2 v46.5,33.6
  Bottom 0.15: v43.4,23.9 44.3,23.9 44.95,24.55 44.95,32.05 v46.5,33.6
N$21  (via drill 0.3)
  Top 0.15: U5.14 35.81,16 42.98,23.18 43.88,23.18 v43.9,23.15 | R13.2 v46.5,32.2
  Bottom 0.15: v43.9,23.15 44.36,23.15 45.25,24.04 45.25,30.95 v46.5,32.2
N$22  (via drill 0.3)
  Top 0.15: v43.2,22.65 43.17,22.62 43.08,22.62 35.96,15.5 U5.15 | R12.2 v46.5,30.8
  Bottom 0.15: v43.2,22.65 43.23,22.62 44.38,22.62 46.25,24.5 46.25,28.66 45.98,28.93 45.98,30.27 v46.5,30.8
N$23  (via drill 0.3)
  Top 0.15: v43.2,21.95 42.85,21.95 35.9,15 U5.16 | R11.2 v46.5,29.4
  Bottom 0.15: v43.2,21.95 44.45,21.95 46.55,24.05 46.55,29.35 v46.5,29.4
N$24  (via drill 0.3)
  Top 0.15: U$3.1 39.58,26.73 39.27,26.43 39.27,25.77 v39.25,25.75 | U5.36 43.27,16.5 v41.73,18.05
  Bottom 0.15: v39.25,25.75 39.45,25.55 39.45,25.54 40.04,24.95 40.59,24.95 41.1,24.44 41.1,21.91 40.92,21.73 40.92,18.85 v41.73,18.05
N$25  (via drill 0.3)
  Top 0.15: U$3.4 41.52,26.68 41.33,26.48 41.33,25.77 v41.35,25.75 | U5.24 38.5,14.05 v41.76,17.31
  Bottom 0.15: v41.35,25.75 41.35,25.53 42,24.88 42,20.53 42.25,20.28 42.25,17.84 41.76,17.35 v41.76,17.31
N$26  (via drill 0.3)
  Top 0.15: U$3.2 40.23,26.68 40.02,26.48 40.02,25.82 v39.95,25.75 | U5.37 43.52,17 v41.73,18.8
  Bottom 0.15: v41.73,18.8 41.55,18.98 41.51,18.98 41.23,19.26 41.23,21.56 41.4,21.73 41.4,24.57 40.72,25.25 40.44,25.25 40.15,25.54 40.15,25.55 v39.95,25.75
N$27  (via drill 0.3)
  Top 0.15: U$3.5 42.17,26.57 42.05,26.45 v42.05,25.75 | v42.26,16.8 42.26,16.51 40,14.26 U5.27
  Bottom 0.15: v42.05,25.75 42.05,25.25 42.3,25 42.3,20.66 42.6,20.36 42.6,17.54 42.26,17.2 v42.26,16.8
N$28  (via drill 0.3)
  Top 0.15: U$3.3 40.88,26.73 40.67,26.53 40.67,25.77 v40.65,25.75 | U5.42 43.51,19.5 42.91,20.1 v41.73,20.1
  Bottom 0.15: v40.65,25.75 40.85,25.55 40.85,25.54 41.7,24.69 41.7,20.12 v41.73,20.1
N$29  (via drill 0.3)
  Top 0.15: U$3.6 42.83,26.52 42.75,26.45 v42.75,25.75 | v42.75,16.3 40.5,14.05 U5.28
  Bottom 0.15: v42.75,25.75 42.75,25 42.6,24.85 42.6,20.85 42.95,20.5 42.95,16.5 v42.75,16.3
N$30
  Top 0.2: R5.1 38.3,33.5 39.16,32.64 39.89,32.64 40.23,32.98 U$3.19
N$31
  Top 0.2: U$3.16 42.17,32.67 41.75,32.25 R6.1
N$32
  Top 0.2: U$3.13 44.12,31.93 43.45,31.25 37.9,31.25 R7.1
N$33  (via drill 0.3)
  Top 0.2: R8.1 v38.5,37.25 | v45.45,34.9 45.42,34.88 U$3.11
  Bottom 0.2: v38.5,37.25 40.85,34.9 v45.45,34.9
N$34  (via drill 0.3)
  Top 0.2: R15.1 v38.45,36 | U$3.10 45.42,28.98 v44.05,30.35
  Bottom 0.2: v38.45,36 44.05,30.4 v44.05,30.35
N$35  (via drill 0.3)
  Top 0.2: R16.1 v38.45,34.75 | v43.2,30.35 44.77,28.77 U$3.9
  Bottom 0.2: v43.2,30.35 38.8,34.75 v38.45,34.75
N$36  (via drill 0.3)
  Top 0.3: J2.A4B9 26.78,8.38 v26.8,8.4 | J2.B4A9 31.58,7.87 v31.2,8.25 | v26.3,12.1 C32.1 25.45,11.95 25.9,11.5 25.9,11 26.1,10.8 U3.7
  Bottom 0.3: v31.2,8.25 30.25,7.3 27.9,7.3 v26.8,8.4 26.8,11.6 v26.3,12.1
N$37
  Top 0.15: R21.2 31.55,10.8 U3.4
N$40  (via drill 0.3)
  Top 0.15: v40.62,18.42 40.62,18.48 41.45,19.3 42.38,19.3 43.18,18.5 U5.40
  Bottom 0.15: X1.3 38.3,45.16 38.3,42.7 37.6,42 37.6,40.93 37,40.33 37,25.07 39.05,23.02 39.05,19.99 v40.62,18.42
N$41  (via drill 0.3)
  Top 0.15: U5.19 36,12.4 36.3,12.1 36.4,12.1 37,11.5 C20.1 37,6.5 v35.05,4.55 | R18.1 6,15.95 v5,15.95
  Bottom 0.15: v35.05,4.55 35.01,4.55 34.51,4.05 34.09,4.05 33.69,4.45 28.38,4.45 27.83,5 24.58,5 23.68,5.9 8.43,5.9 5.7,8.63 5.7,13.58 4.5,14.78 4.5,15.46 4.79,15.75 4.8,15.75 v5,15.95
N$42  (via drill 0.3)
  Top 0.15: U5.18 35.5,11.9 35.95,11.45 C21.1 35.95,6.2 v34.3,4.55 | v5,15.25 R20.1
  Bottom 0.15: v34.3,4.55 34.1,4.75 28.5,4.75 27.95,5.3 24.7,5.3 23.8,6.2 8.55,6.2 6,8.75 6,13.7 5,14.7 v5,15.25
N$43
  Top 0.15: U4.6 5.13,19.64 5.9,20.4 6.95,20.4 R18.2
N$44  (via drill 0.3)
  Top 0.15: U4.7 3.85,18.1 v3.85,16.4 2.5,16.4 2.35,16.55 R20.2
N$45  (via drill 0.3)
  Top 0.15: U2.1 23.66,18.7 23.7,18.65 v23.7,18.05 | v36.23,21.75 37.5,21.75 39,23.25 U5.56
  Bottom 0.15: v23.7,18.05 24.5,17.25 31.09,17.25 31.19,17.15 31.61,17.15 31.9,17.44 31.9,17.7 35.95,21.75 v36.23,21.75
N$46  (via drill 0.3)
  Top 0.15: U2.2 22.39,18.71 22.9,18.2 v22.9,18.05 | v34.2,22.7 34,22.5 U5.1
  Bottom 0.15: v22.9,18.05 23.4,18.55 24.27,18.55 24.37,18.45 25.03,18.45 25.13,18.55 27.43,18.55 27.73,18.85 30.62,18.85 30.82,19.05 31.55,19.05 33.65,21.15 33.65,22.21 34.14,22.7 v34.2,22.7
N$47  (via drill 0.3)
  Top 0.15: U2.3 21.11,18.73 21.15,18.7 v21.15,18.05 | v34.59,23.3 35,23.7 U5.64
  Bottom 0.15: v21.15,18.05 21.95,18.85 24.39,18.85 24.49,18.75 24.91,18.75 25.01,18.85 27.3,18.85 27.6,19.15 30.5,19.15 30.7,19.35 31.43,19.35 33.35,21.27 33.35,22.56 33.99,23.2 34.5,23.2 v34.59,23.3
N$48  (via drill 0.3)
  Top 0.15: v20.35,18.05 20.35,18.2 19.84,18.7 U2.4 | U5.55 39.5,23.15 37.4,21.05 v35.96,21.05
  Bottom 0.15: v35.96,21.05 35.56,20.65 35.27,20.65 32.2,17.58 32.2,17.32 31.73,16.85 31.07,16.85 30.97,16.95 21.45,16.95 v20.35,18.05
N$49  (via drill 0.3)
  Top 0.15: U5.54 v40,23.3
  Bottom 0.15: X1.1 38.59,47.41 38.59,42.57 37.9,41.88 37.9,40.8 37.3,40.2 37.3,25.2 39.2,23.3 v40,23.3
N$51
  Top 0.15: J2.B5 30.93,7.76 30.7,7.99 30.7,8.46 31.04,8.8 R17.2
N$52  (via drill 0.3)
  Top 0.15: J2.A5 27.93,9.53 v28.3,9.9 | v33.2,7.84 32.8,8.24 32.8,9.4 32.15,10.05 R19.2
  Bottom 0.15: v28.3,9.9 31.14,9.9 v33.2,7.84
N$53
  Top 0.3: C31.1 25.15,9.3 U3.10
NRST  (via drill 0.3)
  Top 0.15: v42.9,11.85 43.8,11.85 C2.1 R1.1 45.2,11.8 45.2,12.18 X5.4 | v34.3,17.05 34.25,17 U5.12 | R21.1 32.8,12.05 32.8,13.5 33.6,14.3 36.5,14.3 v37.27,15.07
  Bottom 0.15: v34.3,17.05 35.3,17.05 v37.27,15.07 40.5,11.85 v42.9,11.85
SWCLK
  Top 0.15: U5.46 45.95,21.5 | 45.95,21.5 47.26,21.5 X5.2 | R2.2 45.95,21.5
SWDIO
  Top 0.15: U5.45 46.05,21 47.1,19.95 47.1,19.12 X5.3
U  (via drill 0.3)
  Top 0.2: U$3.18 40.88,35.46 C1.2 40.96,36.99 40.2,37.75 40.2,38.9 39.8,39.3 34.8,39.3
  other vias: 29.3,30.8 29.3,31.6 29.3,32.4 29.3,34 29.3,34.8 29.3,35.6 30.1,35.6 30.1,34.8 30.9,34.8 30.9,35.6 31.7,35.6 31.7,34.8
  pour Top (rank 2, no thermals): 28.75,47 28.75,30.5 35.25,30.5 35.25,47
  pour Bottom (no thermals): 28.75,47 28.75,30.5 35.25,30.5 35.25,47
USART1_RX  (via drill 0.3)
  Top 0.15: R23.1 v30.7,14.5 | v36.5,22.45 U5.61
  Bottom 0.15: v30.7,14.5 31.1,14.9 31.1,15.11 31.39,15.4 31.6,15.4 33.05,16.85 33.05,17.3 33.7,17.95 35.05,17.95 36.73,19.63 36.73,21.96 36.5,22.19 v36.5,22.45
USART1_TX  (via drill 0.3)
  Top 0.15: v31.4,14.2 30.95,13.75 30.7,13.75 R24.1 | v37.2,22.45 37,22.65 U5.60
  Bottom 0.15: v37.2,22.45 37.2,19.68 35.17,17.65 33.82,17.65 33.35,17.18 33.35,16.73 32.1,15.48 32.1,14.69 31.81,14.4 31.6,14.4 v31.4,14.2
USB_N
  Top 0.18: U3.2 30.1,9.8 29.43,9.13 29.43,8.7 | 29.43,8.7 J2.A7 | J2.B7 28.43,7.96 28.4,7.99 28.4,8.41 28.7,8.71 29.13,8.71 29.14,8.7 29.43,8.7
USB_P  (via drill 0.3)
  Top 0.18: U3.1 30.4,9.3 29.93,8.83 29.93,8.19 | J2.B6 29.93,7.4 29.93,8.19 | J2.A6 28.91,7.16 v28.91,8.2 | v29.95,8.2 29.93,8.19
  Bottom 0.18: v28.91,8.2 v29.95,8.2
V  (via drill 0.3)
  Top 0.2: U$3.15 42.83,35.41 C7.2 42.96,36.94 42.15,37.75 42.15,39 41.1,40.05 37.87,40.05 v35.5,42.42
  Route15 0.2: v35.5,42.42 34.31,42.42 33.57,41.67 26.88,41.67 X6.P$5
  other vias: 22.3,30.8 22.3,31.6 22.3,32.4 22.3,34 22.3,34.8 22.3,35.6 23.1,35.6 23.1,34.8 23.9,34.8 23.9,35.6 24.7,35.6 24.7,34.8
  pour Top (rank 2, no thermals): 21.75,47 21.75,30.5 28.25,30.5 28.25,47
  pour Bottom (no thermals): 21.75,47 21.75,30.5 28.25,30.5 28.25,47
VCC  (via drill 0.3)
  Top 0.15: R4.2 v48.8,27.85
  Top 0.3: D11.A D6.A D7.A 44.22,41.58 v44.25,41.55 | C13.1 43.48,26.27 U$3.7 43.48,28.93 v43.5,28.95
  Top 0.5: U6.2@1 U6.2 11.45,15.7 11.25,15 C3.1 9.1,13.9 8.8,13.6
  other vias: 7.25,12 7.25,12.8 7.25,13.6 8.05,12 8.05,12.8 8.05,13.6 8.05,14.4 8.05,15.2 8.05,16 8.05,16.8 7.25,16 7.25,15.2 7.25,14.4 8.85,12 8.85,12.8 8.85,13.6 8.85,14.4 8.85,15.2 8.85,16 8.85,16.8 18.65,29.9 25.65,29.9 32.65,29.9 12.9,33.4 12.9,31.8 11.3,31.8 11.3,33.4 9.7,33.4 9.7,31.8 8.1,31.8 8.1,33.4 8.1,30.2 9.7,30.2 11.3,30.2 12.9,30.2 12.9,28.6 11.3,28.6 9.7,28.6 8.1,28.6 26.45,29.9 33.45,29.9 34.25,29.9 19.45,29.9 27.25,29.9 20.25,29.9 19.05,29.5 19.85,29.5 26.05,29.5 26.85,29.5 33.05,29.5 33.85,29.5 18.25,29.5 20.65,29.5 25.25,29.5 27.65,29.5 32.25,29.5 34.65,29.5
  pour Top (rank 2, no thermals): 4.5,11.5 9.1,11.5 9.1,17.05 7,17.05 7,14 4.5,14
  pour Route15 (rank 6): -2,52 52.75,52 52.75,-3.5 -2,-3.5
  pour Top (no thermals): 17.5,33 21.5,33 21.5,29 17.5,29
  pour Top (no thermals): 24.5,33 28.5,33 28.5,29 24.5,29
  pour Top (no thermals): 31.5,33 35.5,33 35.5,29 31.5,29
  pour Top (rank 3, no thermals): 7.5,40 15.5,40 15.5,31 35.5,31 35.5,26.5 13.5,26.5 13.5,24 7.5,24
  pour Bottom (no thermals): 13.5,34 13.5,11.5 7,11.5 7,34
  pour Bottom (rank 2, no thermals): 13.15,30.7 13.15,23.35 17.7,23.35 21.75,27.4 35.7,27.4 35.7,30.7
VCCIN  (via drill 0.3)
  other vias: 8.25,7.25 8.25,8.25 8.25,9.25 8.25,10.25 8.25,4.25 8.25,3.25 8.25,2.25 8.25,1.25 15.75,7.75 15.75,8.75 15.75,9.75 15.75,10.75 15.75,4.75 15.75,3.75 15.75,2.75 15.75,1.75 0.65,13.75 1.45,13.75 0.65,12.95 0.65,12.15 0.65,11.35 0.65,10.55 1.45,10.55 1.45,12.95 1.45,12.15 1.45,11.35 2.25,10.55 3.05,10.55 3.85,10.55 4.65,10.55 4.65,9.75 3.85,9.75 3.05,9.75 2.25,9.75 4.65,8.95 3.85,8.95 3.05,8.95 9.25,7.25 10.25,7.25 11.25,7.25 12.25,7.25 13.25,7.25 14.25,7.25 9.25,4.75 10.25,4.75 11.25,4.75 12.25,4.75 13.25,4.75 14.25,4.75 8.25,5.25 9.75,4.25 10.75,4.25 11.75,4.25 12.75,4.25 13.75,4.25 14.75,4.25 13.75,7.75 12.75,7.75 11.75,7.75 10.75,7.75 9.75,7.75 8.75,7.75 12.25,3.75 11.75,3.25 12.25,2.75 11.75,2.25 12.25,1.75 11.75,1.25 12.25,8.25 11.75,8.75 12.25,9.25 11.75,9.75 12.25,10.25 11.75,10.75 14.75,7.75 15.25,7.25
  pour Top (no thermals): -0.25,14 4.25,14 4.25,11.25 15.95,11.25 15.95,0.75 7.75,0.75 7.75,5.5 5.5,7.75 3.9,7.75 1.35,10.3 -0.25,10.3
  pour Route15 (rank 4, no thermals): -1,14 4.5,14 4.5,11.5 17.5,11.5 17.5,-1.5 -1.5,-1.5 -1.5,14
VCCMEAS  (via drill 0.3)
  Top 0.15: U5.20 36.5,12.44 36.77,12.17 38.73,12.17 39.35,11.55 C28.1 40.4,10.3 v40.45,10.3 | v46.45,22 46.8,22.35 46.8,24.6 47.5,25.3 R3.2 R4.1
  Bottom 0.15: v46.45,22 43.68,19.23 43.68,11.73 42.25,10.3 v40.45,10.3
W  (via drill 0.3)
  Top 0.2: U$3.12 44.77,35.36 C8.2 44.96,38.49 43.05,40.4 38.02,40.4 36.24,42.17 v36.24,42.42
  Route15 0.2: v36.24,42.42 35.72,41.9 34.28,41.9 33.71,41.33 26.73,41.33 26.38,41.67 19.88,41.67 X7.P$5
  other vias: 15.3,30.8 15.3,31.6 15.3,32.4 15.3,34 15.3,34.8 15.3,35.6 16.1,35.6 16.1,34.8 16.9,34.8 16.9,35.6 17.7,35.6 17.7,34.8
  pour Top (rank 2, no thermals): 14.75,47 14.75,30.5 21.25,30.5 21.25,47
  pour Bottom (no thermals): 14.75,47 14.75,30.5 21.25,30.5 21.25,47

### Text on the board
Top: TOP COPPER
Bottom: BOTTOM COPPER
Dimension: DIMENSION
tStop: V1 | V2 | TOP MASK | V3 | V4
bStop: BOTTOM MASK
tFinish: pcb-bldc- / high-current / v1 2024 / by ftobler | U | V | W | JLCJLCJLCJLC | + | TOP SILK | DRV8300 | 25V 680uF / d=10mm | 3 | + | GND | C | STM32 / G070RBT | D | LTC485 | R | FD6187T | G | 12V | B | A | G
bFinish: BOTTOM SILK
Milling: MILLING